# EAGLE design 4bit_ALU_Cape (EAGLE 8.2.2)
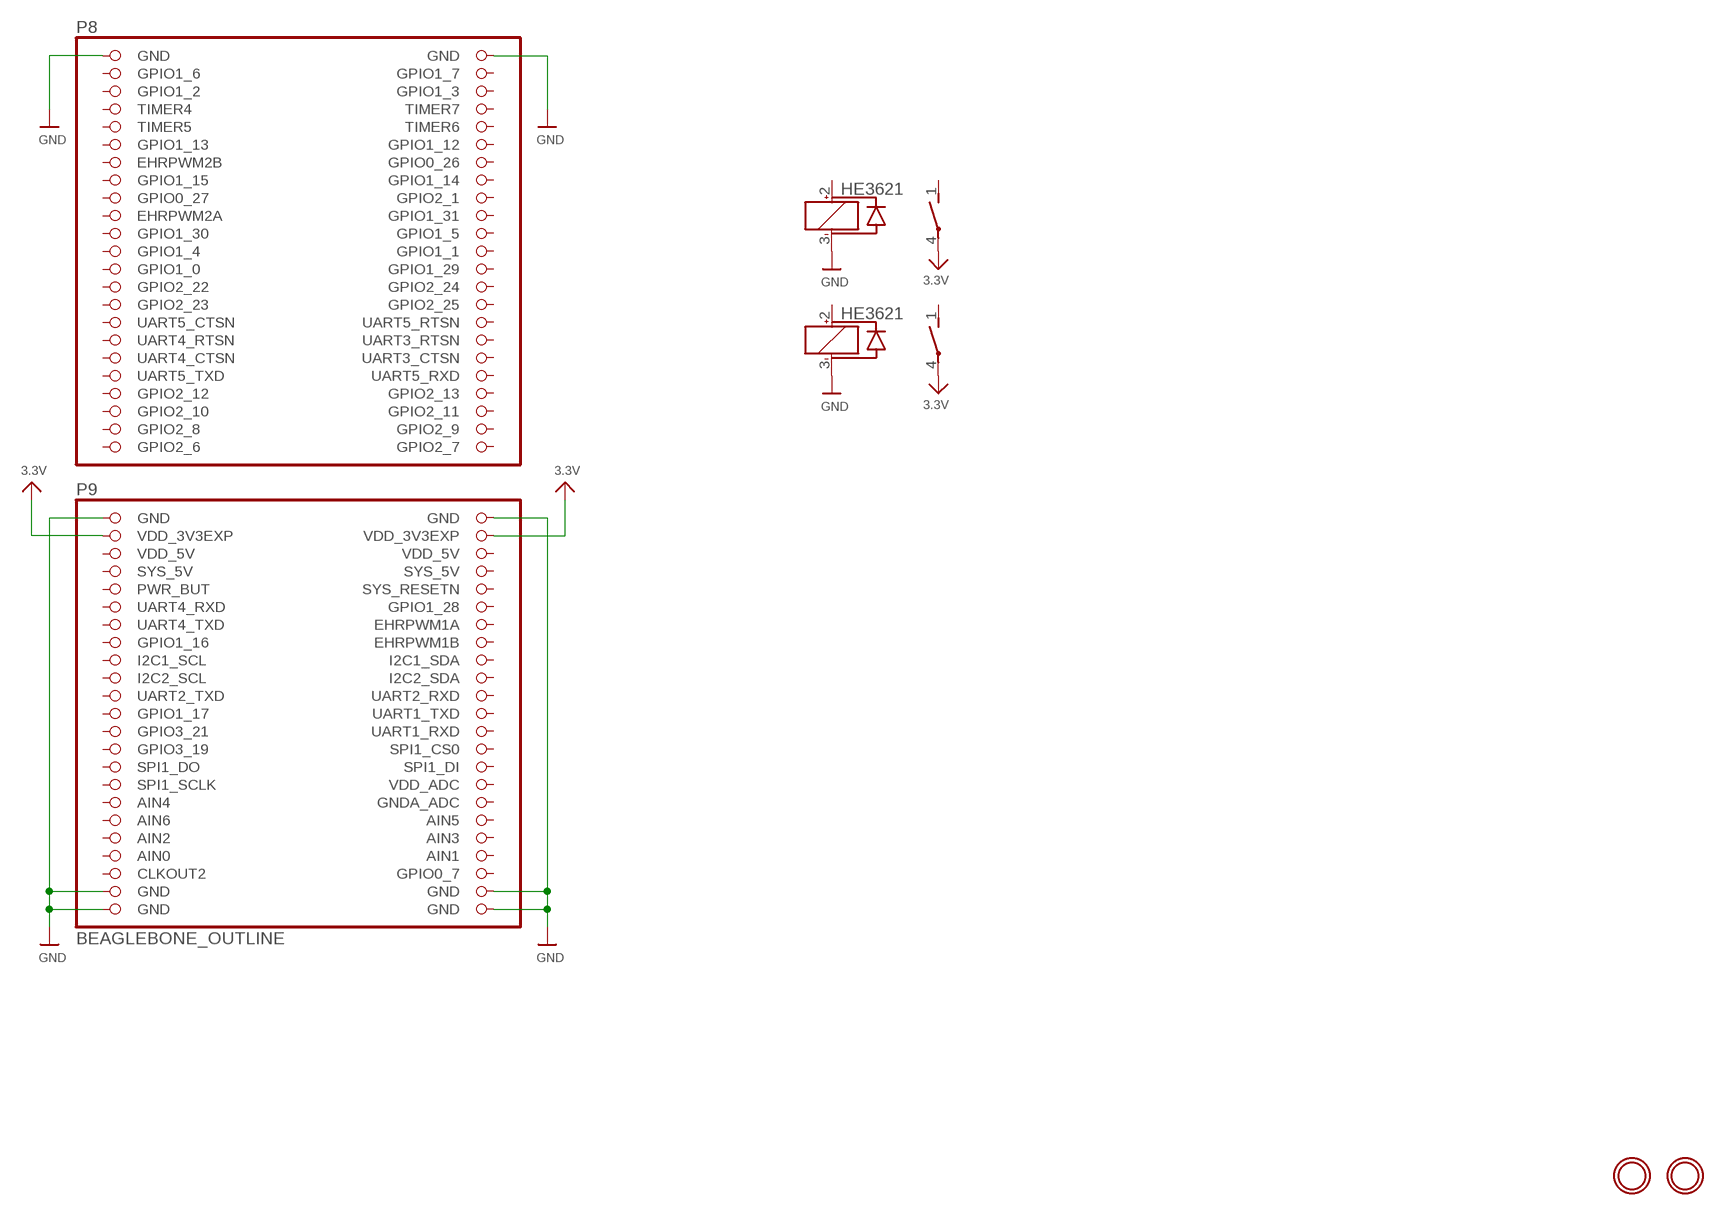
[diagram p0: schematic, sheet 1]

## Parts
K1  HE3621  [HE3621]
K2  HE3621  [HE3621]
U  BEAGLEBONE_OUTLINE  [BEAGLEBONE_SHIELD]
U$22  MOUNTINGHOLE3.0THIN  [MOUNTINGHOLE_3.0_PLATEDTHIN]
U$23  MOUNTINGHOLE3.0THIN  [MOUNTINGHOLE_3.0_PLATEDTHIN]

## Nets
3.3V: K1.4(2:P) K2.4(2:P) U.49(VDD_3V3EXP) U.50(VDD_3V3EXP)
GND: K1.3(1:-) K2.3(1:-) U.1(GND) U.2(GND) U.47(GND) U.48(GND) U.89(GND) U.90(GND) U.91(GND) U.92(GND)
Unconnected: K1.1(2:S) K1.2(1:+) K2.1(2:S) K2.2(1:+) U.5(GPIO1_2) U.6(GPIO1_3) U.7(TIMER4) U.8(TIMER7) U.9(TIMER5) U.10(TIMER6) U.11(GPIO1_13) U.12(GPIO1_12) U.13(EHRPWM2B) U.14(GPIO0_26) U.15(GPIO1_15) U.16(GPIO1_14) U.17(GPIO0_27) U.18(GPIO2_1) U.19(EHRPWM2A) U.20(GPIO1_31) U.21(GPIO1_30) U.22(GPIO1_5) U.23(GPIO1_4) U.24(GPIO1_1) U.25(GPIO1_0) U.26(GPIO1_29) U.27(GPIO2_22) U.28(GPIO2_24) U.29(GPIO2_23) U.30(GPIO2_25) U.31(UART5_CTSN) U.32(UART5_RTSN) U.33(UART4_RTSN) U.34(UART3_RTSN) U.35(UART4_CTSN) U.36(UART3_CTSN) U.37(UART5_TXD) U.38(UART5_RXD) U.39(GPIO2_12) U.40(GPIO2_13) U.41(GPIO2_10) U.53(SYS_5V) U.54(SYS_5V) U.55(PWR_BUT) U.56(SYS_RESETN) U.57(UART4_RXD) U.58(GPIO1_28) U.59(UART4_TXD) U.60(EHRPWM1A) U.61(GPIO1_16) U.62(EHRPWM1B) U.63(I2C1_SCL) U.64(I2C1_SDA) U.65(I2C2_SCL) U.66(I2C2_SDA) U.67(UART2_TXD) U.68(UART2_RXD) U.69(GPIO1_17) U.70(UART1_TXD) U.71(GPIO3_21) U.72(UART1_RXD) U.73(GPIO3_19) U.74(SPI1_CS0) U.75(SPI1_DO) U.76(SPI1_DI) U.77(SPI1_SCLK) U.78(VDD_ADC) U.79(AIN4) U.80(GNDA_ADC) U.81(AIN6) U.82(AIN5) U.83(AIN2) U.86(AIN1) U.87(CLKOUT2) U.88(GPIO0_7)

## Power pins joined to a net without a drawn wire
AIN0: U.85(AIN0)
AIN3: U.84(AIN3)
GPIO1_6: U.3(GPIO1_6)
GPIO1_7: U.4(GPIO1_7)
GPIO2_6: U.45(GPIO2_6)
GPIO2_7: U.46(GPIO2_7)
GPIO2_8: U.43(GPIO2_8)
GPIO2_9: U.44(GPIO2_9)
GPIO2_11: U.42(GPIO2_11)
VDD_5V: U.51(VDD_5V) U.52(VDD_5V)

## Library data of the parts
K1 K2 = relay_computer_custom:HE3621: REED RELAY Reed Relay SPST Normally open Coil Suppression Diode External Magnetic Shield grid 5.65 mm Hamlin; MF: HAMLIN; MPN: HE3621A2450
U = microbuilder:BEAGLEBONE_OUTLINE
U$22 U$23 = microbuilder:MOUNTINGHOLE: Mounting Hole

## Board
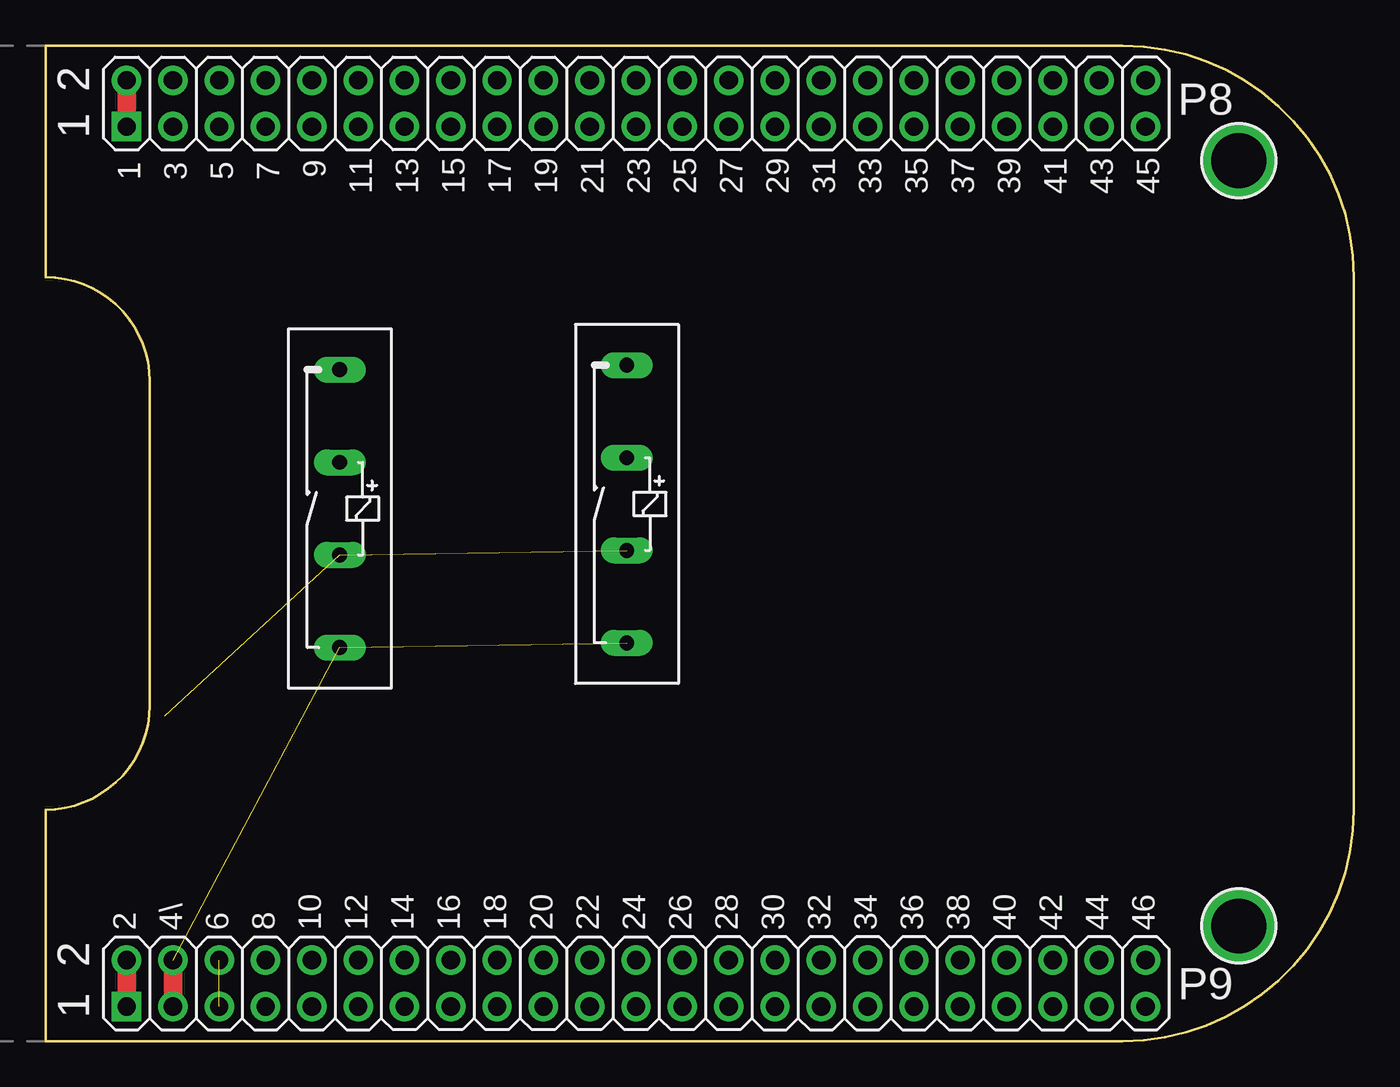
[diagram p1: board, top side]
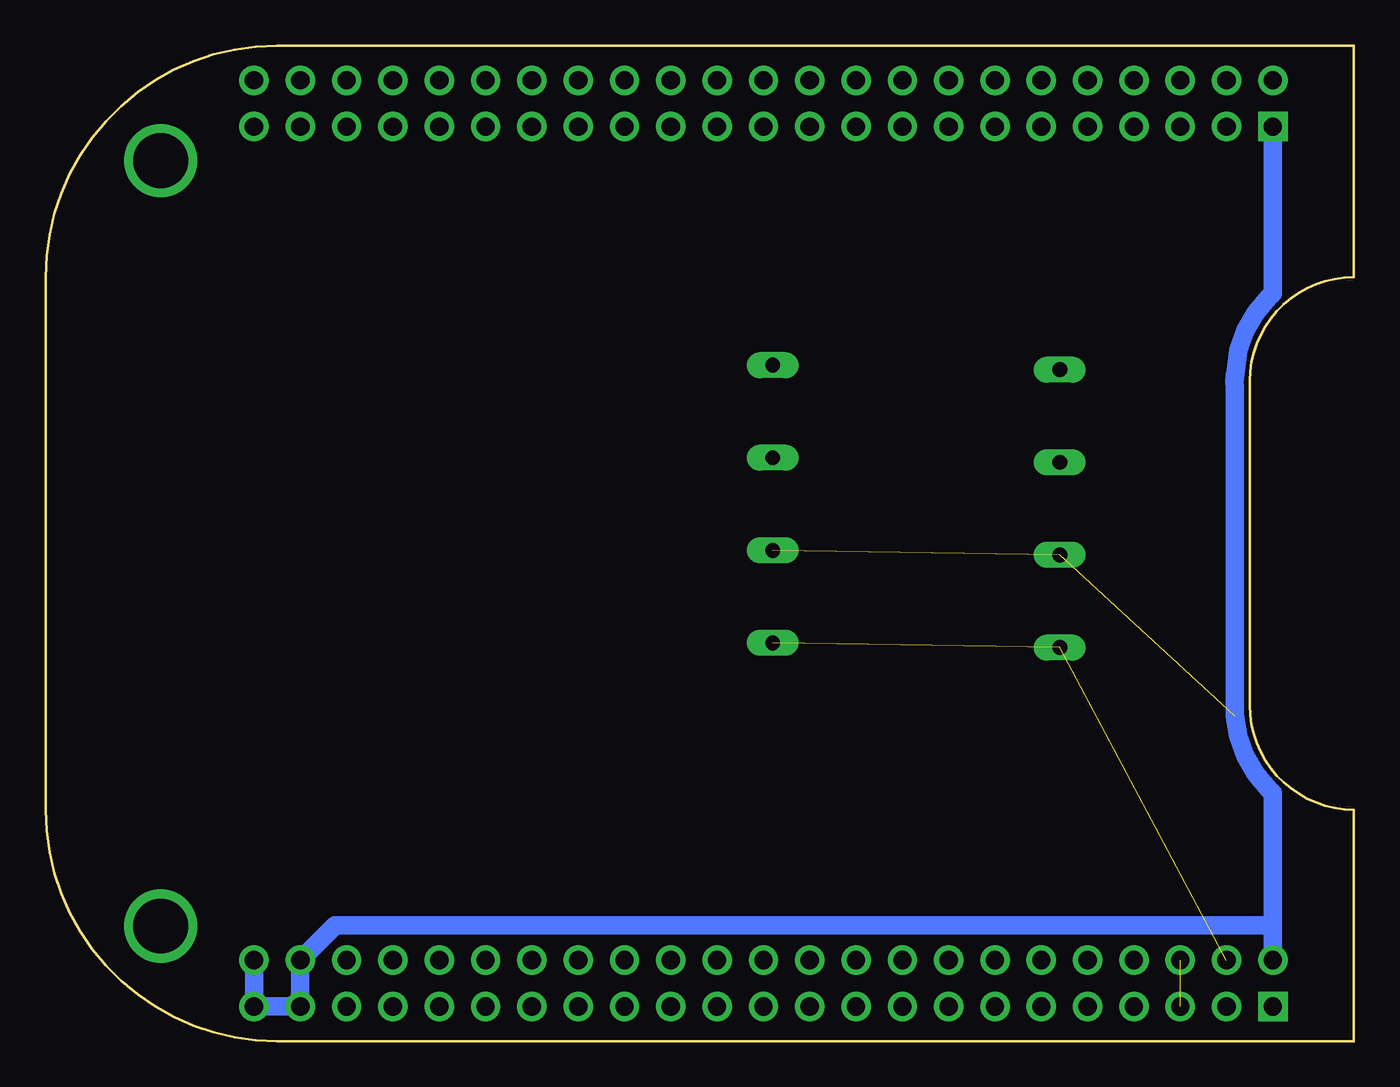
[diagram p2: board, bottom side, seen from below]

Size 71.75 x 54.61 mm. Coordinates in mm from the lower left corner, seen from the top.
Copper layers (1*16): Top 0.035mm / dielectric 1.5mm / Bottom 0.035mm
Design rules "SparkFun10mil": minimum track width 10mil, minimum drill 20mil, track to track 10mil, track to pad 10mil, pad to pad 10mil, via to via 10mil, smd to smd 10mil, copper to edge 10mil, drill to drill 10mil, minimum pad ring 12mil, minimum via ring 10mil, stop-mask expansion 4mil, vias tented up to drill 25mil, thermal gap 10mil

### Footprints (pad centres in the part's own frame; a part is rotated, then mirrored left to right if it is on the bottom)
HE3621 = drill 0.813 long: 1 -7.62,0; 2 -2.54,0; 3 2.54,0; 4 7.62,0
BEAGLEBONE_SHIELD = drill 1 square: 1 4.445,19.05; 47 52.705,19.05 | drill 1: 2 1.905,19.05; 3 4.445,21.59; 4 1.905,21.59; 5 4.445,24.13; 6 1.905,24.13; 7 4.445,26.67; 8 1.905,26.67; 9 4.445,29.21; 10 1.905,29.21; 11 4.445,31.75; 12 1.905,31.75; 13 4.445,34.29; 14 1.905,34.29; 15 4.445,36.83; 16 1.905,36.83; 17 4.445,39.37; 18 1.905,39.37; 19 4.445,41.91; 20 1.905,41.91; 21 4.445,44.45; 22 1.905,44.45; 23 4.445,46.99; 24 1.905,46.99; 25 4.445,49.53; 26 1.905,49.53; 27 4.445,52.07; 28 1.905,52.07; 29 4.445,54.61; 30 1.905,54.61; 31 4.445,57.15; 32 1.905,57.15; 33 4.445,59.69; 34 1.905,59.69; 35 4.445,62.23; 36 1.905,62.23; 37 4.445,64.77; 38 1.905,64.77; 39 4.445,67.31; 40 1.905,67.31; 41 4.445,69.85; 42 1.905,69.85; 43 4.445,72.39; 44 1.905,72.39; 45 4.445,74.93; 46 1.905,74.93; 48 50.165,19.05; 49 52.705,21.59; 50 50.165,21.59; 51 52.705,24.13; 52 50.165,24.13; 53 52.705,26.67; 54 50.165,26.67; 55 52.705,29.21; 56 50.165,29.21; 57 52.705,31.75; 58 50.165,31.75; 59 52.705,34.29; 60 50.165,34.29; 61 52.705,36.83; 62 50.165,36.83; 63 52.705,39.37; 64 50.165,39.37; 65 52.705,41.91; 66 50.165,41.91; 67 52.705,44.45; 68 50.165,44.45; 69 52.705,46.99; 70 50.165,46.99; 71 52.705,49.53; 72 50.165,49.53; 73 52.705,52.07; 74 50.165,52.07; 75 52.705,54.61; 76 50.165,54.61; 77 52.705,57.15; 78 50.165,57.15; 79 52.705,59.69; 80 50.165,59.69; 81 52.705,62.23; 82 50.165,62.23; 83 52.705,64.77; 84 50.165,64.77; 85 52.705,67.31; 86 50.165,67.31; 87 52.705,69.85; 88 50.165,69.85; 89 52.705,72.39; 90 50.165,72.39; 91 52.705,74.93; 92 50.165,74.93
MOUNTINGHOLE_3.0_PLATEDTHIN = drill 3 pad 3.6: P$1 0,0

### Placement (x,y rotation side)
K1  16.13,29.21 270 top
K2  31.88,29.46 270 top
U  -14.61,54.61 270 top
U$22  65.44,48.3 0 top
U$23  65.44,6.32 0 top

### Tracks (layer width: path | path; a pad name or v marks a point on that pad's centre or on a via)
3.3V  (2 unrouted)
  Top 1.016: U.49 U.50
GND  (2 unrouted)
  Top 1.016: U.48 U.47 | U.2 U.1
  Bottom 1.016: U.92 U.91 U.89 U.90 55.88,6.35 4.45,6.35 | U.1 4.45,41 4.64,40.84 5.38,39.96 5.95,38.97 6.34,37.89 6.52,36.56 6.54,36.54 6.54,36.38 6.57,36.2 6.54,35.85 6.54,17.84 6.34,16.72 5.95,15.64 5.38,14.65 4.64,13.77 4.45,13.61 4.45,6.35 | 4.45,6.35 U.48
VDD_5V  (1 unrouted)

### Text on the board
tPlace: 2 | P8 | 1 | 1 | 3 | 5 | 7 | 9 | 11 | 13 | 15 | 17 | 19 | 21 | 23 | 25 | 27 | 29 | 31 | 33 | 35 | 37 | 39 | 41 | 43 | 45 | 2 | 4\ | 6 | 8 | 10 | 12 | 14 | 16 | 18 | 20 | 22 | 24 | 26 | 28 | 30 | 32 | 34 | 36 | 38 | 40 | 42 | 44 | 46 | 2 | P9 | 1